# Altium schematic sheet 07-TCXO_Crystal.SchDoc
size B; SheetNumber: 7; SheetTotal: 14
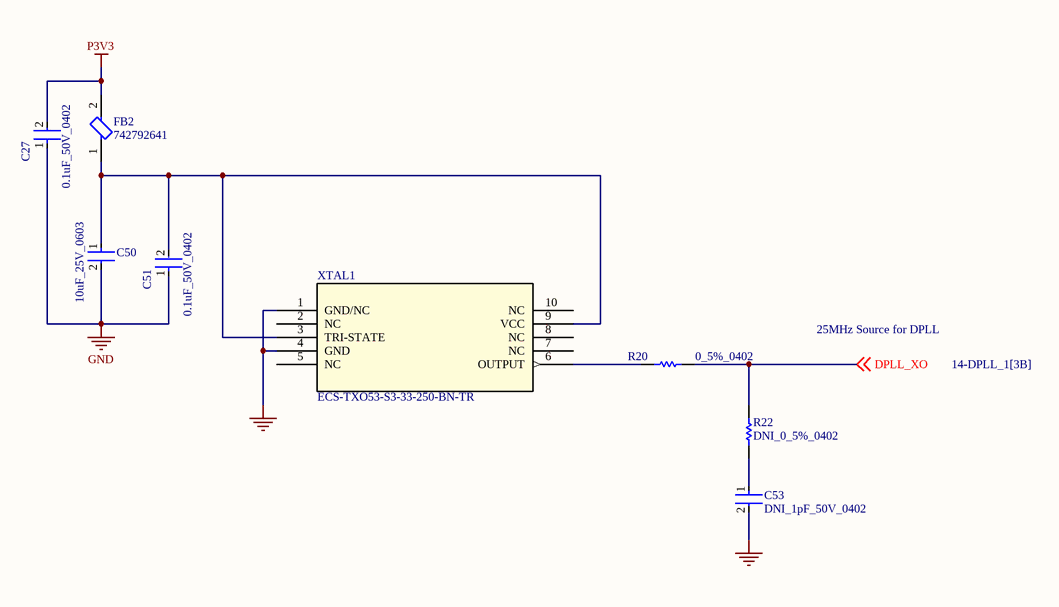
[diagram p0: 07-TCXO_Crystal.SchDoc]

## Parts
C27  0.1uF_50V_0402  [FP-C1005-050-0_05-IPC_C]
C50  10uF_25V_0603  [FP-CL10-IPC_C]
C51  0.1uF_50V_0402  [FP-C1005-050-0_05-IPC_C]
C53  DNI_1pF_50V_0402  [FP-GJM155-0_05-IPC_B]  (no BOM)
FB2  742792641  [FP-742792641-MFG]
R20  0_5%_0402  [RESC1005X40X25NL05T10]
R22  DNI_0_5%_0402  [RESC1005X40X25NL05T10]  (no BOM)
XTAL1  ECS-TXO53-S3-33-250-BN-TR  [SO10_ECS-TXO_ECS]

## Nets
GND: C27.1 C50.2 C51.1 C53.2 XTAL1.1(GND/NC) XTAL1.4(GND)
P3V3: C27.2 FB2.2
DPLL_XO: R20.2 R22.2 ; off-sheet DPLL_XO
NetC50_1: C50.1 C51.2 FB2.1 XTAL1.3(TRI-STATE) XTAL1.9(VCC)
NetC53_1: C53.1 R22.1
NetR20_1: R20.1 XTAL1.6(OUTPUT)

Not connected (* = marked no-connect by the designer): XTAL1 2(NC) 5(NC) 7(NC) 8(NC) 10(NC)

## Notes on the sheet
- 25MHz Source for DPLL

## Library data of the parts
C27 C51 = CMP-2000-05393-2: Multilayer Ceramic Capacitors 100nF ±10% 50V X7R SMD 0402; Voltage: 50V; Dielectric Material: Ceramic; Min Operating Temperature: -55°C; Depth: 0.5mm; Radiation Hardening: No; RoHS Compliant: Yes; Voltage Rating (DC): 50V; Lead Free: Lead Free; Resistor Type: Ceramic; Height: 0.5mm; Dielectric: X7R; Thickness: 0.022inch; Case/Package: 0402; Case Code (Metric): 1005; Termination: SMD/SMT; Capacitance: 100nF; Packaging: Tape and Reel; Max Operating Temperature: 125°C; Mount: Surface Mount; Package Quantity: 1; Width: 0.02inch; Weight: 2.3E-05oz; Voltage Rating: 50V; Tolerance: 10%; Construction: Flat; Case Code (Imperial): 0402; Length: 1mm; REACH SVHC: No SVHC; Series: C
C50 = CMP-13271-004224-1: Cap Ceramic 10uF 25V X5R ±20% Pad SMD 0603 +85°C T/R; Width: 0.031inch; Voltage Rating: 25V; Length: 0.063inch; Case Code (Metric): 1608; Dielectric: X5R; Termination: Wraparound; Capacitance: 10uF; Lead Free: Lead Free; Mount: Surface Mount; Package Quantity: 1; Case Code (Imperial): 0603; Thickness: 0.035inch; Packaging: Tape and Reel; Contact Plating: Tin; Min Operating Temperature: -55°C; Tolerance: 20%; Max Operating Temperature: 85°C; Case/Package: 0603
C53 = CMP-2008-03808-2: Multi-Layer Ceramic Capacitor 1pF C0G  ±0.1pF 0402 Paper T/R; Temperature Coefficient: 30ppm/°C; Voltage Rating (DC): 50V; REACH SVHC: No SVHC; Packaging: Tape and Reel; Width: 0.02inch; Package Quantity: 10000; Min Operating Temperature: -55°C; Case Code (Imperial): 0402; Lead Pitch: 0.3mm; Capacitance: 1pF; Length: 1mm; Max Operating Temperature: 125°C; Depth: 0.5mm; Thickness: 0.022inch; Case Code (Metric): 1005; Lead Free: Lead Free; Voltage: 50V; Mount: Surface Mount; Number of Pins: 2; Termination: SMD/SMT; Radiation Hardening: No; Dielectric: C0G; Case/Package: 0402; Voltage Rating: 50V; Height: 0.5mm
FB2 = CMP-0220-00171-2: FERRITE BEAD 300 OHM 0603 1LN; Inductance: 18nH; Max DC Current: 2A; Number of Lines: 1; Test Frequency: 100MHz; Impedance: 300R; DC Resistance (DCR): 150mR; Tolerance: 25%; Case Code (Metric): 1608; Core Material: Ferrite; Length: 1.6mm; Lead Free: Lead Free; Series: WE-CBF; Min Operating Temperature: -55°C; RoHS Compliant: Yes; Case/Package: SMD/SMT; Material: Ferrite; Max Operating Temperature: 125°C; Termination: SMD/SMT; Packaging: Tape and Reel; Weight: 0.000141oz; Case Code (Imperial): 0603; Width: 0.8mm; Mount: Surface Mount; Max Current Rating: 2A; Package Quantity: 1; Depth: 0.8mm; Current Rating: 2A; Height: 0.8mm
R20 R22 = CMP-2002-06457-1: Manufacturer: Panasonic; Part Number: ERJ-U020R00X
XTAL1 = ECS-TXO53-S3-33-250-BN-TR: No Description Available; Mfr_Name: ECS International; Type: Oscillators; RefDes: RefDes